# EAGLE design AW9523 (EAGLE 9.6.2)
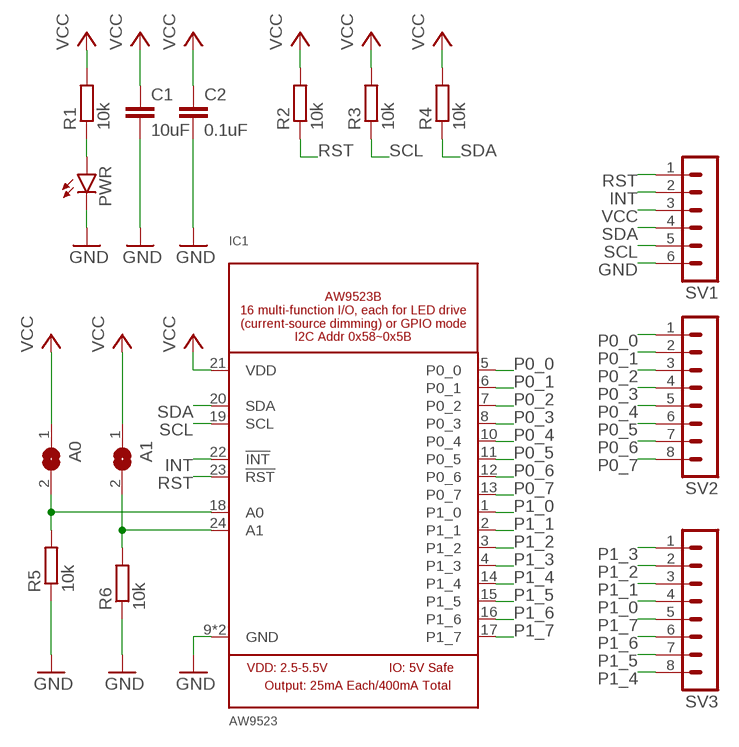
[diagram p0: schematic, sheet 1]

## Parts
A0  SJ  [SJ]
A1  SJ  [SJ]
C1  10uF  C-EUC0603  [C0603]
C2  0.1uF  C-EUC0603  [C0603]
IC1  AW9523  [QFN24_4MM_SMSC]
PWR  LEDCHIP-LED0603  [CHIP-LED0603]
R1  10k  R-EU_R0603  [R0603]
R2  10k  R-EU_R0603  [R0603]
R3  10k  R-EU_R0603  [R0603]
R4  10k  R-EU_R0603  [R0603]
R5  10k  R-EU_R0603  [R0603]
R6  10k  R-EU_R0603  [R0603]
SV1  MA06-1  [MA06-1]
SV2  MA08-1  [MA08-1]
SV3  MA08-1  [MA08-1]

## Nets
GND: C1.2 C2.2 IC1.9(GND) IC1.GND PWR.C R5.1 R6.1 SV1.6
INT: IC1.22(!INT) SV1.2
N$17: A0.2 IC1.18(A0) R5.2
N$18: A1.2 IC1.24(A1) R6.2
N$19: PWR.A R1.1
P0_0: IC1.5(P0_0) SV2.1
P0_1: IC1.6(P0_1) SV2.2
P0_2: IC1.7(P0_2) SV2.3
P0_3: IC1.8(P0_3) SV2.4
P0_4: IC1.10(P0_4) SV2.5
P0_5: IC1.11(P0_5) SV2.6
P0_6: IC1.12(P0_6) SV2.7
P0_7: IC1.13(P0_7) SV2.8
P1_0: IC1.1(P1_0) SV3.4
P1_1: IC1.2(P1_1) SV3.3
P1_2: IC1.3(P1_2) SV3.2
P1_3: IC1.4(P1_3) SV3.1
P1_4: IC1.14(P1_4) SV3.8
P1_5: IC1.15(P1_5) SV3.7
P1_6: IC1.16(P1_6) SV3.6
P1_7: IC1.17(P1_7) SV3.5
RST: IC1.23(!RST) R2.1 SV1.1
SCL: IC1.19(SCL) R3.1 SV1.5
SDA: IC1.20(SDA) R4.1 SV1.4
VCC: A0.1 A1.1 C1.1 C2.1 IC1.21(VDD) R1.2 R2.2 R3.2 R4.2 SV1.3

## Library data of the parts
A0 A1 = jumper:SJ: SMD solder JUMPER
C1 C2 = rcl:C-EU: CAPACITOR, European symbol; SPICEPREFIX: C
IC1 = AW9523:AW9523
PWR = led:LED: LED OSRAM: - CHIPLED LG R971, LG N971, LY N971, LG Q971, LY Q971, LO R971, LY R971 LH N974, LH R974 LS Q976, LO Q976, LY Q976 LO Q996 - Hyper CHIPLED LW Q18S LB Q993, LB Q99A, LB R99A - SideLED LS A670, LO A670, LY A670, LG A670, LP A670 LB A673, LV A673, LT A673, LW A673 LH A674 LY A675 LS A676, LA A676, LO A676, LY A676, LW A676 LS A679, LY A679, LG A679 - Hyper Micro SIDELED® LS Y876, LA Y876, LO Y876, LY Y876 LT Y87S - SmartLED LW L88C, LW L88S LB L89C, LB L89S, LG L890 LS L89K, LO L89K, LY L89K LS L896, LA L896, LO L896, LY L896 - TOPLED LS T670, LO T670, LY T670, LG T670, LP T670 LSG T670, LSP T670, LSY T670, LOP T670, LYG T670 LG T671, LOG T671, LSG T671 LB T673, LV T673, LT T673, LW T673 LH T674 LS T676, LA T676, LO T676, LY T676, LB T676, LH T676, LSB T676, LW T676 LB T67C, LV T67C, LT T67C, LS T67K, LO T67K, LY T67K, LW E67C LS E67B, LA E67B, LO E67B, LY E67B, LB E67C, LV E67C, LT E67C LW T67C LS T679, LY T679, LG T679 LS T770, LO T770, LY T770, LG T770, LP T770 LB T773, LV T773, LT T773, LW T773 LH T774 LS E675, LA E675, LY E675, LS T675 LS T776, LA T776, LO T776, LY T776, LB T776 LHGB T686 LT T68C, LB T68C - Hyper Mini TOPLED® LB M676 - Mini TOPLED Santana® LG M470 LS M47K, LO M47K, LY M47K Source: http://www.osram.convergy.de LUXEON: - LUMILED® LXK2-PW12-R00, LXK2-PW12-S00, LXK2-PW14-U00, LXK2-PW14-V00 LXK2-PM12-R00, LXK2-PM12-S00, LXK2-PM14-U00 LXK2-PE12-Q00, LXK2-PE12-R00, LXK2-PE12-S00, LXK2-PE14-T00, LXK2-PE14-U00 LXK2-PB12-K00, LXK2-PB12-L00, LXK2-PB12-M00, LXK2-PB14-N00, LXK2-PB14-P00, LXK2-PB14-Q00 LXK2-PR12-L00, LXK2-PR12-M00, LXK2-PR14-Q00, LXK2-PR14-R00 LXK2-PD12-Q00, LXK2-PD12-R00, LXK2-PD12-S00 LXK2-PH12-R00, LXK2-PH12-S00 LXK2-PL12-P00, LXK2-PL12-Q00, LXK2-PL12-R00 Source: www.luxeon.com KINGBRIGHT: KA-3528ASYC Source: www.kingbright.com
R1-R6 = rcl:R-EU_: RESISTOR, European symbol; SPICEPREFIX: R
SV1 = con-lstb:MA06-1: PIN HEADER; OC_FARNELL: unknown; OC_NEWARK: unknown
SV2 SV3 = con-lstb:MA08-1: PIN HEADER; OC_FARNELL: unknown; OC_NEWARK: unknown

## Board
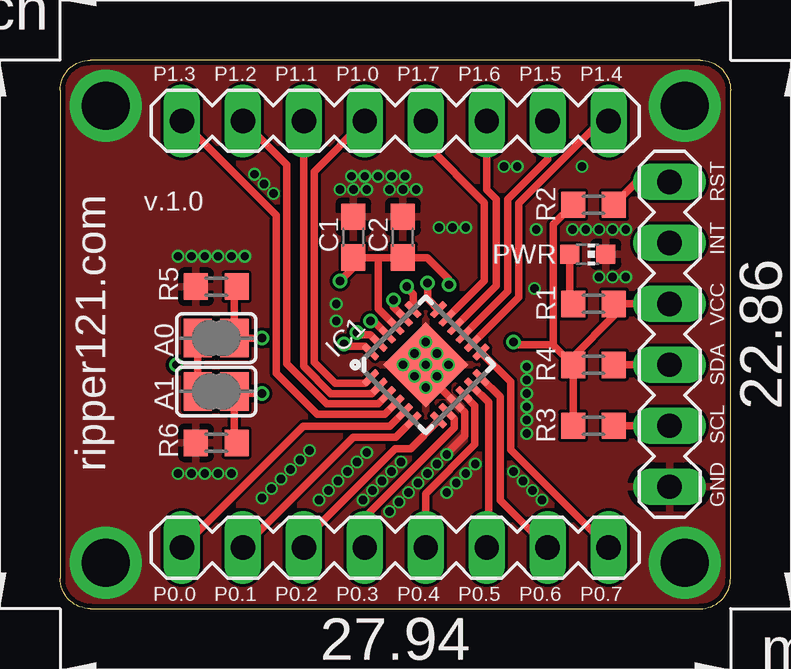
[diagram p1: board, top side]
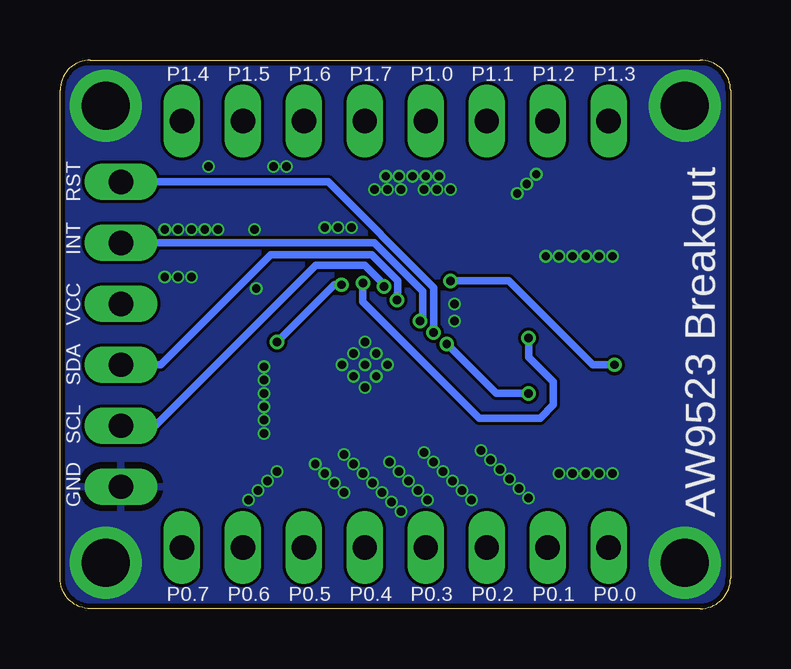
[diagram p2: board, bottom side, seen from below]

Size 27.94 x 22.86 mm. Coordinates in mm from the lower left corner, seen from the top.
Outline: 1.27,0 26.67,0 arc90 27.94,1.27 27.94,21.59 arc90 26.67,22.86 1.27,22.86 arc90 0,21.59 0,1.27 arc90 1.27,0
Copper layers (1*16): Top 0.035559375mm / dielectric 1.6mm / Bottom 0.035559375mm
Design rules "jlcpcb2layer": minimum track width 5mil, minimum drill 12mil, track to track 5mil, track to pad 5mil, pad to pad 5mil, via to via 5mil, smd to smd 5mil, copper to edge 8mil, drill to drill 6mil, minimum pad ring 5mil, minimum via ring 3mil, stop-mask expansion 2.5mil, vias tented up to drill 0mil, thermal gap 10mil

### Footprints (pad centres in the part's own frame; a part is rotated, then mirrored left to right if it is on the bottom)
SJ = smd 1.168 x 1.6: 1 -0.762,0; 2 0.762,0
C0603 = smd 1.1 x 1: 1 -0.85,0; 2 0.85,0
QFN24_4MM_SMSC = smd 0.8 x 0.28: 1 -2,1.25; 2 -2,0.75; 3 -2,0.25; 4 -2,-0.25; 5 -2,-0.75; 6 -2,-1.25; 13 2,-1.25; 14 2,-0.75; 15 2,-0.25; 16 2,0.25; 17 2,0.75; 18 2,1.25 | smd 0.28 x 0.8: 7 -1.25,-2; 8 -0.75,-2; 9 -0.25,-2; 10 0.25,-2; 11 0.75,-2; 12 1.25,-2; 19 1.25,2; 20 0.75,2; 21 0.25,2; 22 -0.25,2; 23 -0.75,2; 24 -1.25,2 | smd 2.5 x 2.5: GND 0,0
CHIP-LED0603 = smd 0.8 x 0.8: A 0,-0.75; C 0,0.75
R0603 = smd 1 x 1.1: 1 -0.85,0; 2 0.85,0
MA06-1 = drill 1.016 long: 1 -6.35,0; 2 -3.81,0; 3 -1.27,0; 4 1.27,0; 5 3.81,0; 6 6.35,0
MA08-1 = drill 1.016 long: 1 -8.89,0; 2 -6.35,0; 3 -3.81,0; 4 -1.27,0; 5 1.27,0; 6 3.81,0; 7 6.35,0; 8 8.89,0

### Placement (x,y rotation side)
A0  6.51,11.27 0 top
A1  6.51,9.05 0 top
C1  12.22,15.48 90 top
C2  14.29,15.48 90 top
IC1  15.24,10.16 45 top
PWR  21.99,14.76 270 top
R1  22.23,12.7 0 top
R2  22.23,16.83 180 top
R3  22.23,7.62 180 top
R4  22.23,10.16 180 top
R5  6.51,13.41 0 top
R6  6.51,6.91 0 top
SV1  25.4,11.43 270 top
SV2  13.97,2.54 0 top
SV3  13.97,20.32 0 top

### Tracks (layer width: path | path; a pad name or v marks a point on that pad's centre or on a via)
GND  (via drill 0.35, 2 pad 0.6)
  Top 0.305: IC1.GND 15.24,9.81 IC1.9 16.86,8.19 16.86,7.2 16.11,6.45 v16.11,6.43
  other vias: 15.24,10.16 14.76,9.68 15.72,10.64 16.19,10.16 15.72,9.68 15.24,9.21 14.29,10.16 14.76,10.64 15.24,11.11 8.41,4.6 8.81,5 9.21,5.4 9.6,5.79 10,6.19 10.4,6.59 10.79,4.52 11.19,4.92 11.59,5.32 11.99,5.71 12.38,6.11 12.78,6.51 14.21,6.11 13.81,5.71 13.41,5.32 13.02,4.92 12.62,4.52 15.72,6.03 15.32,5.64 14.92,5.24 14.53,4.84 14.13,4.45 13.73,4.05 18.89,5.71 19.29,5.32 19.68,4.92 20.08,4.52 17.3,6.03 16.91,5.64 16.51,5.24 16.11,4.84 8.89,17.3 8.49,17.7 8.1,18.1 11.51,11.99 11.51,12.7 12.22,17.46 14.29,17.46 13.73,17.46 12.78,17.46 11.67,17.46 14.84,17.46 13.26,18.02 13.81,18.02 12.7,18.02 12.14,18.02 14.37,18.02 6.59,14.68 7.14,14.68 7.7,14.68 6.03,14.68 5.48,14.68 4.92,14.68 6.59,5.64 7.14,5.64 6.03,5.64 5.48,5.64 4.92,5.64 19.76,13.34 21.35,15.8 21.91,15.8 22.46,15.8 23.02,15.8 23.57,15.8 19.84,15.8 21.75,18.41 18.49,18.41 19.05,18.41 15.8,15.88 16.35,15.88 16.91,15.88 19.45,10.08 19.45,9.53 19.45,8.97 19.45,8.41 19.45,7.86 19.45,7.3 23.02,13.81 22.46,13.81 23.57,13.81 1.91,20.95 1.91,1.91 26.04,1.91 26.04,20.95
  pour Top: 0,0 0,22.86 27.94,22.86 27.94,0
  pour Bottom: 0,0 0,22.86 27.94,22.86 27.94,0
INT  (via drill 0.35 pad 0.6)
  Top 0.305: v12.94,11.99 13.06,11.99 IC1.22
  Bottom 0.305: v12.94,11.99 12.84,12.09 12.84,13.23 14.84,15.24 SV1.2
N$17  (via drill 0.35 pad 0.6)
  Top 0.305: R5.2 7.27,13.33 A0.2 v8.41,11.27 | v15.32,13.57 15.32,12.91 IC1.18
  Bottom 0.305: v15.32,13.57 15.32,12.78 10.48,7.94 7.94,7.94 7.38,8.49 7.38,9.45 8.41,10.48 v8.41,11.27
N$18  (via drill 0.35 pad 0.6)
  Top 0.305: R6.2 7.27,6.99 A1.2 7.35,8.97 v8.41,8.97 | v11.83,11.03 11.83,11.01 11.9,10.93 12.7,10.93 IC1.24
  Bottom 0.305: v8.41,8.97 9.76,8.97 v11.83,11.03
N$19
  Top 0.305: R1.1 21.24,12.84 PWR.A
P0_0
  Top 0.305: IC1.5 13.74,7.6 10.14,7.6 SV2.1
P0_1
  Top 0.305: IC1.6 13.99,7.14 12.22,7.14 SV2.2
P0_2
  Top 0.305: IC1.7 15.77,7.83 14.61,6.67 13.97,6.67 10.16,2.86 SV2.3
P0_3
  Top 0.305: IC1.8 16.43,7.91 16.43,7.54 12.7,3.81 SV2.4
P0_4
  Top 0.305: SV2.5 15.24,4.79 17.29,6.84 17.29,8.46 IC1.10
P0_5
  Top 0.305: SV2.6 17.86,2.62 17.86,8.6 IC1.11
P0_6
  Top 0.305: IC1.12 18.35,8.82 18.35,4.51 SV2.7
P0_7
  Top 0.305: SV2.8 18.78,6.62 18.78,9.45 IC1.13
P1_0
  Top 0.305: IC1.1 12.71,9.4 11.46,9.4 10.59,10.27 10.59,18.21 SV3.4
P1_1
  Top 0.305: IC1.2 12.98,8.96 11.29,8.96 10.16,10.09 SV3.3
P1_2
  Top 0.305: IC1.3 13.25,8.53 11.11,8.53 9.44,10.2 9.44,18.5 SV3.2
P1_3
  Top 0.305: IC1.4 13.53,8.1 10.72,8.1 9.01,9.8 9.01,16.39 SV3.1
P1_4
  Top 0.305: IC1.14 19.12,12.98 19.12,16.89 22.55,20.32 SV3.8
P1_5
  Top 0.305: SV3.7 20.32,18.73 18.65,17.07 18.65,13.22 IC1.15
P1_6
  Top 0.305: IC1.16 18.18,13.45 18.18,17.07 17.78,17.46 SV3.6
P1_7
  Top 0.305: IC1.17 17.69,13.67 17.69,16.92 15.24,19.37 SV3.5
RST  (via drill 0.35 pad 0.6)
  Top 0.305: v12.38,11.51 12.38,11.48 12.46,11.41 12.93,11.41 IC1.23 | R2.1 24.03,17.78 SV1.1
  Bottom 0.305: v12.38,11.51 12.38,11.72 12.36,11.75 12.36,13.37 16.77,17.78 SV1.1
SCL  (via drill 0.35 pad 0.6)
  Top 0.305: v14.45,13.41 14.45,13.36 14.71,13.09 IC1.19 | R3.1 SV1.5
  Bottom 0.305: v14.45,13.41 14.45,13.52 15.24,14.31 17.28,14.31 23.97,7.62 SV1.5
SDA  (via drill 0.35 pad 0.6)
  Top 0.305: IC1.20 13.89,12.57 v13.89,12.86 | R4.1 SV1.4
  Bottom 0.305: v13.89,12.86 13.89,13.15 13.87,13.17 13.87,13.65 14.96,14.74 19.15,14.74 23.73,10.16 SV1.4
VCC  (via drill 0.35 pad 0.6)
  Top 0.305: A1.1 5.75,10.16 | 5.75,10.16 A0.1 | 13.26,14.63 C2.1 15.31,14.63 16.2,13.73 v16.2,13.49 | 13.26,14.63 C1.1 12.22,14.21 v11.67,13.65 | IC1.21 13.26,12.5 13.26,14.63 | R3.2 R4.2 | R4.2 21.38,10.5 23.07,12.2 R1.2 SV1.3 | R4.2 20.56,10.98 | 20.56,10.98 20.53,11.01 19,11.01 v18.89,11.11 | R2.2 20.56,16.01 20.56,10.98 | v4.84,10.16 5.75,10.16
  Bottom 0.305: v18.89,11.11 16.51,13.49 v16.2,13.49 | v11.67,13.65 9.24,13.65 5.75,10.16 v4.84,10.16

### Text on the board
tPlace: inch | mm
tNames: P1.3 | P1.2 | P1.1 | P1.0 | P1.7 | P1.6 | P1.5 | P1.4 | RST | v.1.0 | INT | VCC | SDA | SCL | ripper121.com | GND | P0.0 | P0.1 | P0.2 | P0.3 | P0.4 | P0.5 | P0.6 | P0.7
bNames: P1.3 | P1.2 | P1.1 | P1.0 | P1.7 | P1.6 | P1.5 | P1.4 | RST | INT | VCC | SDA | SCL | GND | AW9523 Breakout | P0.0 | P0.1 | P0.2 | P0.3 | P0.4 | P0.5 | P0.6 | P0.7